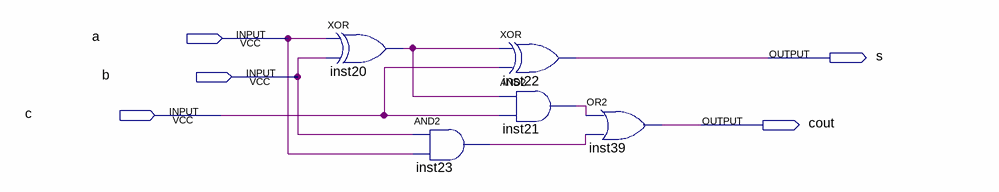
[diagram p0: schematic sheet]
// Quartus schematic fullAdder.bdf as structural Verilog: 5 symbols, 5 pins
module fullAdder (
  input  a,
  input  b,
  input  c,
  output s,
  output cout
);

  wire inst20_out, inst21_out, inst23_out;

  xor inst20 (inst20_out, a, b);
  and inst23 (inst23_out, b, a);
  xor inst22 (s, inst20_out, c);
  and inst21 (inst21_out, inst20_out, c);
  or inst39 (cout, inst21_out, inst23_out);
endmodule
